# EAGLE schematic CAN_ProtoBoard (EAGLE 7.2.0)
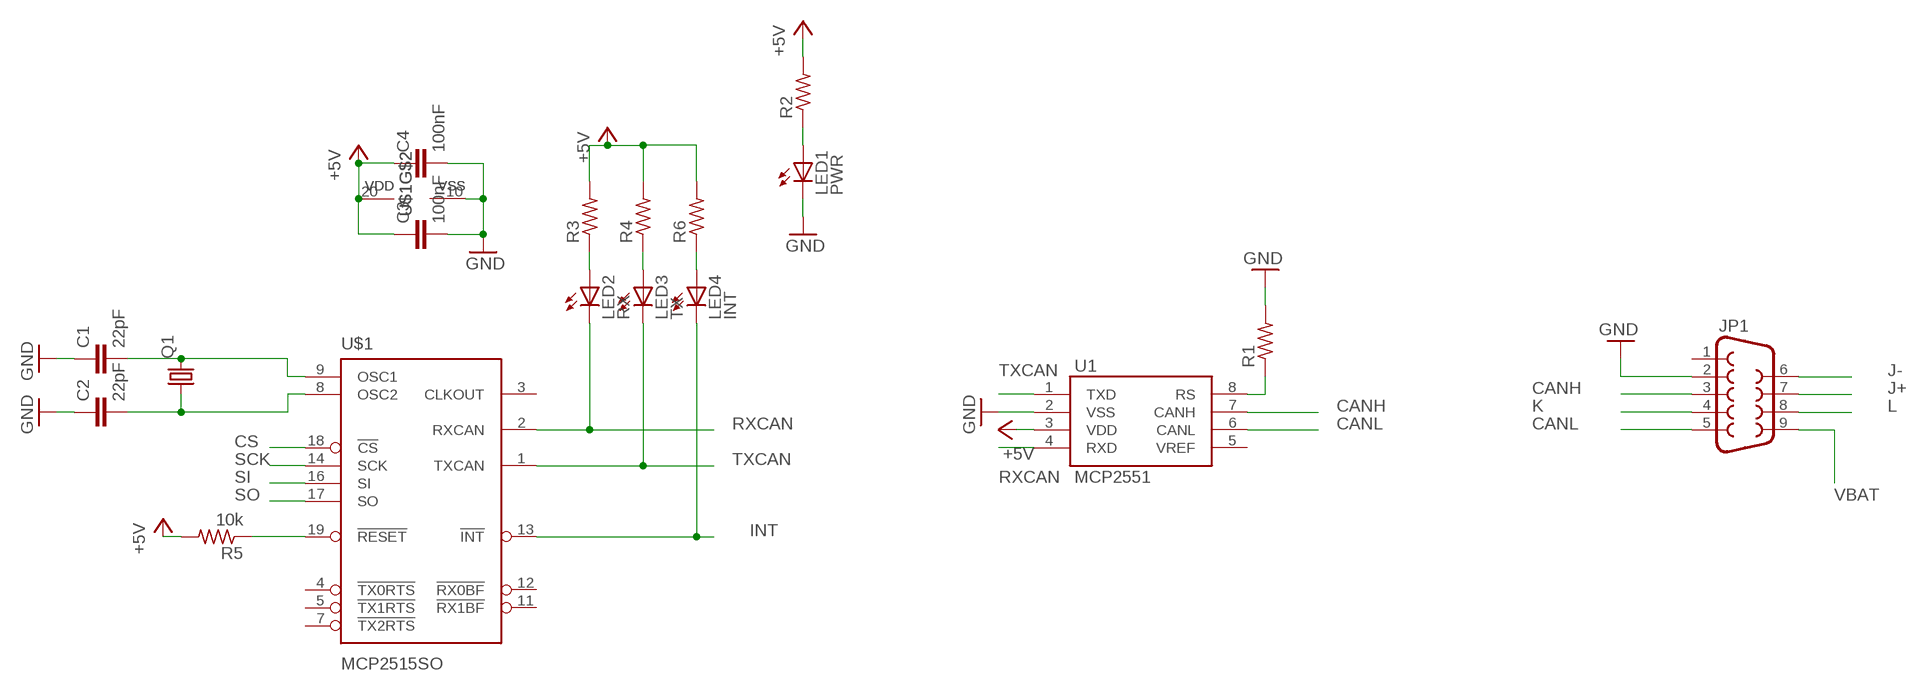
[diagram p0: schematic, sheet 1]

## Parts
C1  22pF  C-EUC0805K  [C0805K]
C2  22pF  C-EUC0805K  [C0805K]
C3  100nF  C-EUC0805K  [C0805K]
C4  100nF  C-EUC0805K  [C0805K]
JP1  DB9MALE  [DB9_MALE]
LED1  PWR  LEDCHIPLED_0805  [CHIPLED_0805]
LED2  RX  LEDCHIPLED_0805  [CHIPLED_0805]
LED3  TX  LEDCHIPLED_0805  [CHIPLED_0805]
LED4  INT  LEDCHIPLED_0805  [CHIPLED_0805]
Q1  CRYSTALHC49S  [HC49/S]
R1  R-US_R0805  [R0805]
R2  R-US_R0805  [R0805]
R3  R-US_R0805  [R0805]
R4  R-US_R0805  [R0805]
R5  10k  R-US_R0805  [R0805]
R6  R-US_R0805  [R0805]
U1  MCP2551  [SO08]
U$1  MCP2515SO  [TSSOP20]

## Nets
+5V: C3.1 C4.1 R2.2 R3.2 R4.2 R5.2 R6.2 U1.3(VDD) U$1.20(VDD)
CANH: JP1.3 U1.7(CANH)
CANL: JP1.5 U1.6(CANL)
CS: U$1.18(!CS)
GND: C1.1 C2.1 C3.2 C4.2 JP1.2 LED1.C R1.2 U1.2(VSS) U$1.10(VSS)
INT: LED4.C U$1.13(!INT)
J+: JP1.7
J-: JP1.6
K: JP1.4
L: JP1.8
N$1: C1.2 Q1.2 U$1.9(OSC1)
N$2: C2.2 Q1.1 U$1.8(OSC2)
N$3: LED2.A R3.1
N$4: LED3.A R4.1
N$5: R5.1 U$1.19(!RESET)
N$6: LED1.A R2.1
N$7: LED4.A R6.1
N$8: R1.1 U1.8(RS)
RXCAN: LED2.C U1.4(RXD) U$1.2(RXCAN)
SCK: U$1.14(SCK)
SI: U$1.16(SI)
SO: U$1.17(SO)
TXCAN: LED3.C U1.1(TXD) U$1.1(TXCAN)
VBAT: JP1.9
Unconnected: JP1.1 U1.5(VREF) U$1.3(CLKOUT) U$1.4(!TX0RTS) U$1.5(!TX1RTS) U$1.7(!TX2RTS) U$1.11(!RX1BF) U$1.12(!RX0BF)

## Library data of the parts
C1-C4 = resistor:C-EU: CAPACITOR, European symbol
JP1 = SparkFun-Connectors:DB9: DB9 Connector Standard DB9 (D-Sub 9) serial connector. Can be used for CAN bus as well as RS485 and RS232. Footprint production proven. Spark Fun Electronics SKU : PRT-00429; PROD_ID: CONN-09904
LED1-LED4 = led:LED: LED OSRAM: - CHIPLED LG R971, LG N971, LY N971, LG Q971, LY Q971, LO R971, LY R971 LH N974, LH R974 LS Q976, LO Q976, LY Q976 LO Q996 - Hyper CHIPLED LW Q18S LB Q993, LB Q99A, LB R99A - SideLED LS A670, LO A670, LY A670, LG A670, LP A670 LB A673, LV A673, LT A673, LW A673 LH A674 LY A675 LS A676, LA A676, LO A676, LY A676, LW A676 LS A679, LY A679, LG A679 - Hyper Micro SIDELED® LS Y876, LA Y876, LO Y876, LY Y876 LT Y87S - SmartLED LW L88C, LW L88S LB L89C, LB L89S, LG L890 LS L89K, LO L89K, LY L89K LS L896, LA L896, LO L896, LY L896 - TOPLED LS T670, LO T670, LY T670, LG T670, LP T670 LSG T670, LSP T670, LSY T670, LOP T670, LYG T670 LG T671, LOG T671, LSG T671 LB T673, LV T673, LT T673, LW T673 LH T674 LS T676, LA T676, LO T676, LY T676, LB T676, LH T676, LSB T676, LW T676 LB T67C, LV T67C, LT T67C, LS T67K, LO T67K, LY T67K, LW E67C LS E67B, LA E67B, LO E67B, LY E67B, LB E67C, LV E67C, LT E67C LW T67C LS T679, LY T679, LG T679 LS T770, LO T770, LY T770, LG T770, LP T770 LB T773, LV T773, LT T773, LW T773 LH T774 LS E675, LA E675, LY E675, LS T675 LS T776, LA T776, LO T776, LY T776, LB T776 LHGB T686 LT T68C, LB T68C - Hyper Mini TOPLED® LB M676 - Mini TOPLED Santana® LG M470 LS M47K, LO M47K, LY M47K Source: http://www.osram.convergy.de LUXEON: - LUMILED® LXK2-PW12-R00, LXK2-PW12-S00, LXK2-PW14-U00, LXK2-PW14-V00 LXK2-PM12-R00, LXK2-PM12-S00, LXK2-PM14-U00 LXK2-PE12-Q00, LXK2-PE12-R00, LXK2-PE12-S00, LXK2-PE14-T00, LXK2-PE14-U00 LXK2-PB12-K00, LXK2-PB12-L00, LXK2-PB12-M00, LXK2-PB14-N00, LXK2-PB14-P00, LXK2-PB14-Q00 LXK2-PR12-L00, LXK2-PR12-M00, LXK2-PR14-Q00, LXK2-PR14-R00 LXK2-PD12-Q00, LXK2-PD12-R00, LXK2-PD12-S00 LXK2-PH12-R00, LXK2-PH12-S00 LXK2-PL12-P00, LXK2-PL12-Q00, LXK2-PL12-R00 Source: www.luxeon.com KINGBRIGHT: KA-3528ASYC Source: www.kingbright.com
Q1 = crystal:CRYSTAL: CRYSTAL; OC_FARNELL: 1667008; OC_NEWARK: unknown
R1-R6 = resistor:R-US_: RESISTOR, American symbol
U1 = SparkFun-DigitalIC:MCP2551: CAN transceiver; PROD_ID: IC-09907
U$1 = RobThePyro:MCP2515: MCP2515 CAN Controller by Microchip